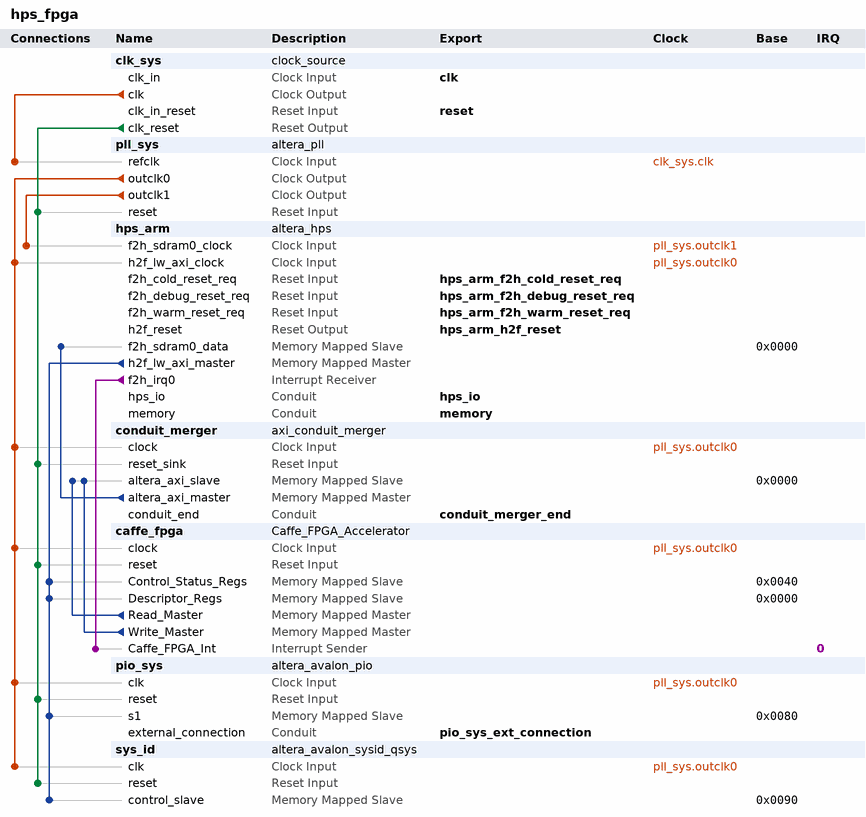
[diagram p0: system contents]
# Platform Designer (Qsys) system hps_fpga, Cyclone V 5CSEMA5F31C6
# Parameters at their usual value, and those the tool derives, are not listed.
package require -exact qsys 15.1
create_system hps_fpga
set_project_property DEVICE_FAMILY {Cyclone V}
set_project_property DEVICE 5CSEMA5F31C6

add_instance clk_sys clock_source 15.1
set_instance_parameter_value clk_sys clockFrequency 50000000

add_instance pll_sys altera_pll 15.1
set_instance_parameter_value pll_sys gui_device_speed_grade 1
set_instance_parameter_value pll_sys gui_number_of_clocks 2
set_instance_parameter_value pll_sys gui_operation_mode direct
set_instance_parameter_value pll_sys gui_output_clock_frequency0 143.0
set_instance_parameter_value pll_sys gui_output_clock_frequency1 143.0
set_instance_parameter_value pll_sys gui_phase_shift_deg1 -52.0
set_instance_parameter_value pll_sys gui_pll_mode {Integer-N PLL}
set_instance_parameter_value pll_sys gui_ps_units1 degrees
set_instance_parameter_value pll_sys gui_reference_clock_frequency 50.0
set_instance_parameter_value pll_sys gui_use_locked false

add_instance hps_arm altera_hps 15.1
set_instance_parameter_value hps_arm EMAC1_Mode RGMII
set_instance_parameter_value hps_arm EMAC1_PinMuxing {HPS I/O Set 0}
set_instance_parameter_value hps_arm F2SCLK_COLDRST_Enable true
set_instance_parameter_value hps_arm F2SCLK_DBGRST_Enable true
set_instance_parameter_value hps_arm F2SCLK_WARMRST_Enable true
set_instance_parameter_value hps_arm F2SDRAM_Type AXI-3
set_instance_parameter_value hps_arm F2SDRAM_Width 128
set_instance_parameter_value hps_arm F2SINTERRUPT_Enable true
set_instance_parameter_value hps_arm F2S_Width 0
set_instance_parameter_value hps_arm FPGA_PERIPHERAL_OUTPUT_CLOCK_FREQ_EMAC0_GTX_CLK 125
set_instance_parameter_value hps_arm FPGA_PERIPHERAL_OUTPUT_CLOCK_FREQ_EMAC0_MD_CLK 2.5
set_instance_parameter_value hps_arm FPGA_PERIPHERAL_OUTPUT_CLOCK_FREQ_EMAC1_GTX_CLK 125
set_instance_parameter_value hps_arm FPGA_PERIPHERAL_OUTPUT_CLOCK_FREQ_EMAC1_MD_CLK 2.5
set_instance_parameter_value hps_arm HPS_PROTOCOL DDR3
set_instance_parameter_value hps_arm I2C0_Mode N/A
set_instance_parameter_value hps_arm I2C0_PinMuxing Unused
set_instance_parameter_value hps_arm I2C1_Mode N/A
set_instance_parameter_value hps_arm I2C1_PinMuxing Unused
set_instance_parameter_value hps_arm LWH2F_Enable true
set_instance_parameter_value hps_arm MEM_BANKADDR_WIDTH 3
set_instance_parameter_value hps_arm MEM_CLK_FREQ 400.0
set_instance_parameter_value hps_arm MEM_COL_ADDR_WIDTH 10
set_instance_parameter_value hps_arm MEM_DQ_WIDTH 40
set_instance_parameter_value hps_arm MEM_DRV_STR RZQ/6
set_instance_parameter_value hps_arm MEM_ROW_ADDR_WIDTH 15
set_instance_parameter_value hps_arm MEM_RTT_NOM RZQ/6
set_instance_parameter_value hps_arm MEM_RTT_WR RZQ/4
set_instance_parameter_value hps_arm MEM_TCL 7
set_instance_parameter_value hps_arm MEM_TFAW_NS 30.0
set_instance_parameter_value hps_arm MEM_TRAS_NS 35.0
set_instance_parameter_value hps_arm MEM_TRCD_NS 13.75
set_instance_parameter_value hps_arm MEM_TRFC_NS 260.0
set_instance_parameter_value hps_arm MEM_TRP_NS 13.75
set_instance_parameter_value hps_arm MEM_TRRD_NS 10.0
set_instance_parameter_value hps_arm MEM_TRTP_NS 10.0
set_instance_parameter_value hps_arm MEM_VENDOR JEDEC
set_instance_parameter_value hps_arm MEM_WTCL 6
set_instance_parameter_value hps_arm QSPI_Mode N/A
set_instance_parameter_value hps_arm QSPI_PinMuxing Unused
set_instance_parameter_value hps_arm REF_CLK_FREQ 25.0
set_instance_parameter_value hps_arm S2FCLK_USER2CLK 1
set_instance_parameter_value hps_arm S2F_Width 0
set_instance_parameter_value hps_arm SDIO_Mode {4-bit Data}
set_instance_parameter_value hps_arm SDIO_PinMuxing {HPS I/O Set 0}
set_instance_parameter_value hps_arm SPIM1_Mode N/A
set_instance_parameter_value hps_arm SPIM1_PinMuxing Unused
set_instance_parameter_value hps_arm STM_Enable false
set_instance_parameter_value hps_arm TIMING_BOARD_AC_SKEW 0.02
set_instance_parameter_value hps_arm TIMING_BOARD_AC_TO_CK_SKEW 0.0
set_instance_parameter_value hps_arm TIMING_BOARD_DQ_TO_DQS_SKEW 0.0
set_instance_parameter_value hps_arm TIMING_BOARD_MAX_CK_DELAY 0.6
set_instance_parameter_value hps_arm TIMING_BOARD_MAX_DQS_DELAY 0.6
set_instance_parameter_value hps_arm TIMING_BOARD_SKEW_BETWEEN_DQS 0.02
set_instance_parameter_value hps_arm TIMING_BOARD_SKEW_CKDQS_DIMM_MAX 0.01
set_instance_parameter_value hps_arm TIMING_BOARD_SKEW_CKDQS_DIMM_MIN -0.01
set_instance_parameter_value hps_arm TIMING_BOARD_SKEW_WITHIN_DQS 0.02
set_instance_parameter_value hps_arm TIMING_TDH 45
set_instance_parameter_value hps_arm TIMING_TDQSCK 225
set_instance_parameter_value hps_arm TIMING_TDQSQ 100
set_instance_parameter_value hps_arm TIMING_TDQSS 0.27
set_instance_parameter_value hps_arm TIMING_TDS 10
set_instance_parameter_value hps_arm TIMING_TDSH 0.18
set_instance_parameter_value hps_arm TIMING_TDSS 0.18
set_instance_parameter_value hps_arm TIMING_TIH 120
set_instance_parameter_value hps_arm TIMING_TIS 170
set_instance_parameter_value hps_arm TIMING_TQSH 0.4
set_instance_parameter_value hps_arm UART0_Mode {No Flow Control}
set_instance_parameter_value hps_arm UART0_PinMuxing {HPS I/O Set 0}
set_instance_parameter_value hps_arm USB1_Mode SDR
set_instance_parameter_value hps_arm USB1_PinMuxing {HPS I/O Set 0}
set_instance_parameter_value hps_arm desired_cfg_clk_mhz 100.0
set_instance_parameter_value hps_arm desired_qspi_clk_mhz 400.0

add_instance conduit_merger axi_conduit_merger 1.0
set_instance_parameter_value conduit_merger AXCACHE_EN 0
set_instance_parameter_value conduit_merger AXPROT_EN 0
set_instance_parameter_value conduit_merger AXUSER_EN 0
set_instance_parameter_value conduit_merger AXUSER_WIDTH 5
set_instance_parameter_value conduit_merger BUSER_EN 0
set_instance_parameter_value conduit_merger BUSER_WIDTH 5
set_instance_parameter_value conduit_merger DATA_WIDTH 128
set_instance_parameter_value conduit_merger ID_WIDTH 8
set_instance_parameter_value conduit_merger RUSER_EN 0
set_instance_parameter_value conduit_merger RUSER_WIDTH 5
set_instance_parameter_value conduit_merger WUSER_EN 0
set_instance_parameter_value conduit_merger WUSER_WIDTH 5

add_instance caffe_fpga Caffe_FPGA_Accelerator 1.0
set_instance_parameter_value caffe_fpga ADDRESS_WIDTH 32
set_instance_parameter_value caffe_fpga CSR_ADDRESS_WIDTH 4
set_instance_parameter_value caffe_fpga DATA_WIDTH 32
set_instance_parameter_value caffe_fpga DESC_ADDRESS_WIDTH 4
set_instance_parameter_value caffe_fpga FIFO_DEPTH 32
set_instance_parameter_value caffe_fpga FIFO_DEPTH_LOG2 5

add_instance pio_sys altera_avalon_pio 15.1
set_instance_parameter_value pio_sys direction InOut
set_instance_parameter_value pio_sys resetValue 252645135
set_instance_parameter_value pio_sys width 32

add_instance sys_id altera_avalon_sysid_qsys 15.1
set_instance_parameter_value sys_id id 232849605

# connections
add_connection clk_sys.clk pll_sys.refclk clock
add_connection pll_sys.outclk0 caffe_fpga.clock clock
add_connection pll_sys.outclk0 conduit_merger.clock clock
add_connection pll_sys.outclk0 hps_arm.h2f_lw_axi_clock clock
add_connection pll_sys.outclk0 pio_sys.clk clock
add_connection pll_sys.outclk0 sys_id.clk clock
add_connection pll_sys.outclk1 hps_arm.f2h_sdram0_clock clock
add_connection clk_sys.clk_reset caffe_fpga.reset reset
add_connection clk_sys.clk_reset conduit_merger.reset_sink reset
add_connection clk_sys.clk_reset pio_sys.reset reset
add_connection clk_sys.clk_reset pll_sys.reset reset
add_connection clk_sys.clk_reset sys_id.reset reset
add_connection caffe_fpga.Read_Master conduit_merger.altera_axi_slave avalon
set_connection_parameter_value caffe_fpga.Read_Master/conduit_merger.altera_axi_slave baseAddress 0x0000
add_connection caffe_fpga.Write_Master conduit_merger.altera_axi_slave avalon
set_connection_parameter_value caffe_fpga.Write_Master/conduit_merger.altera_axi_slave baseAddress 0x0000
add_connection conduit_merger.altera_axi_master hps_arm.f2h_sdram0_data avalon
set_connection_parameter_value conduit_merger.altera_axi_master/hps_arm.f2h_sdram0_data baseAddress 0x0000
add_connection hps_arm.h2f_lw_axi_master caffe_fpga.Control_Status_Regs avalon
set_connection_parameter_value hps_arm.h2f_lw_axi_master/caffe_fpga.Control_Status_Regs baseAddress 0x0040
add_connection hps_arm.h2f_lw_axi_master caffe_fpga.Descriptor_Regs avalon
set_connection_parameter_value hps_arm.h2f_lw_axi_master/caffe_fpga.Descriptor_Regs baseAddress 0x0000
add_connection hps_arm.h2f_lw_axi_master pio_sys.s1 avalon
set_connection_parameter_value hps_arm.h2f_lw_axi_master/pio_sys.s1 baseAddress 0x0080
add_connection hps_arm.h2f_lw_axi_master sys_id.control_slave avalon
set_connection_parameter_value hps_arm.h2f_lw_axi_master/sys_id.control_slave baseAddress 0x0090
add_connection hps_arm.f2h_irq0 caffe_fpga.Caffe_FPGA_Int interrupt
set_connection_parameter_value hps_arm.f2h_irq0/caffe_fpga.Caffe_FPGA_Int irqNumber 0

# exported interfaces
add_interface clk clock sink
set_interface_property clk EXPORT_OF clk_sys.clk_in
add_interface conduit_merger_end conduit end
set_interface_property conduit_merger_end EXPORT_OF conduit_merger.conduit_end
add_interface hps_arm_f2h_cold_reset_req reset sink
set_interface_property hps_arm_f2h_cold_reset_req EXPORT_OF hps_arm.f2h_cold_reset_req
add_interface hps_arm_f2h_debug_reset_req reset sink
set_interface_property hps_arm_f2h_debug_reset_req EXPORT_OF hps_arm.f2h_debug_reset_req
add_interface hps_arm_f2h_warm_reset_req reset sink
set_interface_property hps_arm_f2h_warm_reset_req EXPORT_OF hps_arm.f2h_warm_reset_req
add_interface hps_arm_h2f_reset reset source
set_interface_property hps_arm_h2f_reset EXPORT_OF hps_arm.h2f_reset
add_interface hps_io conduit end
set_interface_property hps_io EXPORT_OF hps_arm.hps_io
add_interface memory conduit end
set_interface_property memory EXPORT_OF hps_arm.memory
add_interface pio_sys_ext_connection conduit end
set_interface_property pio_sys_ext_connection EXPORT_OF pio_sys.external_connection
add_interface reset reset sink
set_interface_property reset EXPORT_OF clk_sys.clk_in_reset

set_interconnect_requirement {$system} qsys_mm.clockCrossingAdapter HANDSHAKE
set_interconnect_requirement {$system} qsys_mm.enableEccProtection FALSE
set_interconnect_requirement {$system} qsys_mm.insertDefaultSlave FALSE
set_interconnect_requirement {$system} qsys_mm.maxAdditionalLatency 1

save_system hps_fpga.qsys
